# Altium schematic sheet DI_DO_AI_AO.SchDoc
size A4
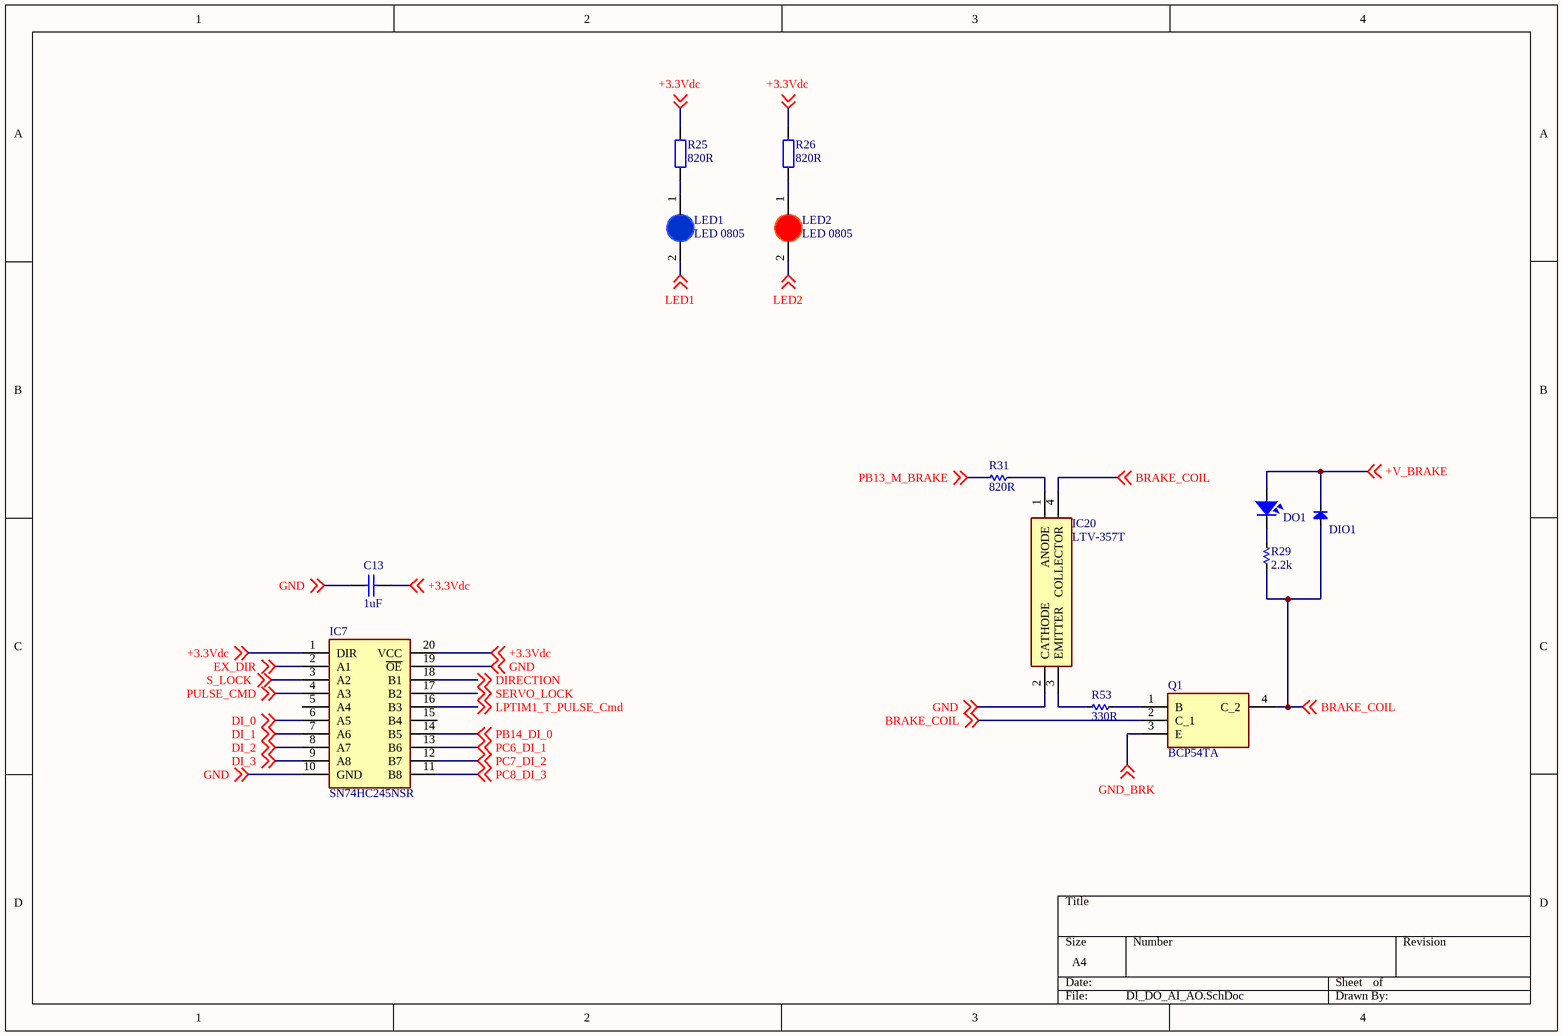
[diagram p0: DI_DO_AI_AO.SchDoc]

## Parts
C13  1uF  [tu 0805]
DIO1  Diode SMD  [DIO-SMD-106]  (value not drawn)
DO1  LED  [LED-0805-Yellow]  (value not drawn)
IC7  SN74HC245NSR  [SOIC127P780X200-20N]
IC20  LTV-357T  [LTV-357T]
LED1  LED 0805  [LED-0805-Blue]
LED2  LED 0805  [LED-0805-Red]
Q1  BCP54TA  [SOT230P700X165-4N]
R25  820R  [tro smd 0805]
R26  820R  [tro smd 0805]
R29  2.2k  [RES-SMD-0805]
R31  820R  [RES-SMD-0805]
R53  330R  [RES-SMD-0805]

## Nets
+3.3Vdc: C13.1 IC7.1(DIR) IC7.20(VCC) R25.2 R26.2 ; off-sheet +3.3Vdc
+V_BRAKE: DIO1.2(K) DO1.1 ; off-sheet +V_BRAKE
BRAKE_COIL: DIO1.1(A) IC20.4(COLLECTOR) Q1.2(C_1) Q1.4(C_2) R29.2 ; off-sheet BRAKE_COIL
DI_0: IC7.6(A5) ; off-sheet DI_0
DI_1: IC7.7(A6) ; off-sheet DI_1
DI_2: IC7.8(A7) ; off-sheet DI_2
DI_3: IC7.9(A8) ; off-sheet DI_3
DIRECTION: IC7.18(B1) ; off-sheet DIRECTION
EX_DIR: IC7.2(A1) ; off-sheet EX_DIR
GND: C13.2 IC7.10(GND) IC7.19(~{OE}) IC20.2(CATHODE) ; off-sheet GND
GND_BRK: Q1.3(E) ; off-sheet GND_BRK
LED1: LED1.2(K) ; off-sheet LED1
LED2: LED2.2(K) ; off-sheet LED2
LPTIM1_T_PULSE_Cmd: IC7.16(B3) ; off-sheet LPTIM1_T_PULSE_Cmd
PB13_M_BRAKE: R31.2 ; off-sheet PB13_M_BRAKE
PB14_DI_0: IC7.14(B5) ; off-sheet PB14_DI_0
PC6_DI_1: IC7.13(B6) ; off-sheet PC6_DI_1
PC7_DI_2: IC7.12(B7) ; off-sheet PC7_DI_2
PC8_DI_3: IC7.11(B8) ; off-sheet PC8_DI_3
PULSE_CMD: IC7.4(A3) ; off-sheet PULSE_CMD
S_LOCK: IC7.3(A2) ; off-sheet S_LOCK
SERVO_LOCK: IC7.17(B2) ; off-sheet SERVO_LOCK
NetDO1_2: DO1.2 R29.1
NetIC20_1: IC20.1(ANODE) R31.1
NetIC20_3: IC20.3(EMITTER) R53.2
NetLED1_1: LED1.1(A) R25.1
NetLED2_1: LED2.1(A) R26.1
NetQ1_1: Q1.1(B) R53.1

Not connected (* = marked no-connect by the designer): IC7 5(A4) 15(B4)

## Library data of the parts
C13 = Tu 0805 10pF 50V 10%: Dán; Don_Vi: Con; So_Chan: 2; Ten_Linh_Kien: Tụ 0805 10P 10% 50V; Ma_Hang: MH004554; Chung_Loai: Dán; Kieu_Chan: *
DIO1 = Diode SMD: Default Diode; Code - JEDEC: DO-214-AB; Value: 1N5007; Published: 8-Jun-2000; Revision: July-2002: Re-released for DXP Platform.; Publisher: Altium Limited
DO1 = LED SMD: Value: LED 3 - 5 ly 2 Colour
IC7 = SN74HC245NSR: Integrated Circuit; Manufacturer_Name: Texas Instruments; Datasheet Link: https://www.ti.com/lit/gpn/SN74HC245; Height: 2mm; Manufacturer_Part_Number: SN74HC245NSR; Mouser Part Number: 595-SN74HC245NSR; Mouser Price/Stock: https://www.mouser.co.uk/ProductDetail/Texas-Instruments/SN74HC245NSR?qs=YhsVCygOPE264XdBhel1Tg%3D%3D; Arrow Part Number: SN74HC245NSR; Arrow Price/Stock: https://www.arrow.com/en/products/sn74hc245nsr/texas-instruments?region=nac
IC20 = LTV-357T: Integrated Circuit; Manufacturer_Name: Lite-On; Datasheet Link: http://uk.rs-online.com/web/p/products/6912088; Manufacturer_Part_Number: LTV-357T; Mouser Part Number: 859-LTV-357T; Mouser Price/Stock: https://www.mouser.co.uk/ProductDetail/Lite-On/LTV-357T?qs=IhlP1sn3qi5zhJzi4zUCwQ%3D%3D; Arrow Part Number: LTV-357T; Arrow Price/Stock: https://www.arrow.com/en/products/ltv-357t/lite-on-technology?region=nac
LED1 = LED 0805 Xanh Duong: Dán; Don_Vi: Con; Ma_Hang: MH002327; Ten_Linh_Kien: LED 0805 Màu Xanh Dương (Blue); Ghi_Chu: *; Kieu_Chan: *; Chung_Loai: Dán
LED2 = LED 0805 Do: Dán; Don_Vi: Con; Ma_Hang: MH000897; Ten_Linh_Kien: LED 0805 Màu Đỏ (Red); Ghi_Chu: *; Kieu_Chan: *; Chung_Loai: Dán
Q1 = BCP54TA: Transistor BJT NPN; Manufacturer_Name: Diodes Inc.; Datasheet Link: https://www.diodes.com/assets/Datasheets/BCP54_55_56.pdf; Height: 1.65mm; Manufacturer_Part_Number: BCP54TA; Mouser Part Number: 522-BCP54TA; Mouser Price/Stock: https://www.mouser.co.uk/ProductDetail/Diodes-Incorporated/BCP54TA?qs=fKsNvYl5pt81P4xkpCoZ4w%3D%3D; Arrow Part Number: BCP54TA; Arrow Price/Stock: https://www.arrow.com/en/products/bcp54ta/diodes-incorporated?region=nac
R25 R26 = Tro 0805 1% 2k: Dán; Don_Vi: Con; So_Chan: 2; Ten_Linh_Kien: Trở 0805 1% 2k; Ma_Hang: MH005471; Chung_Loai: Dán; Kieu_Chan: *
R29 R31 R53 = Res-SMD: Resistor; Manufacturer: Generic Components; Class: Passive; Published: 08/06/2000; Publisher: Altium Hobart Technology Centre